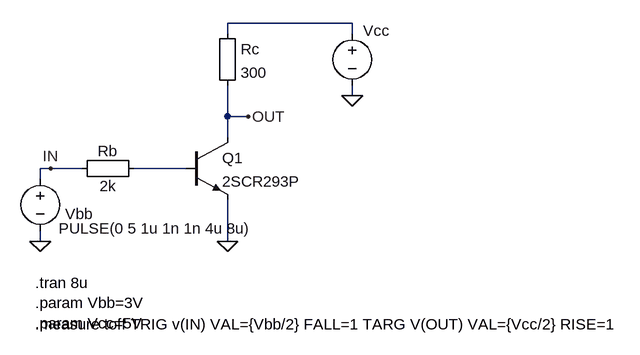
[diagram p0: schematic BT-CE-SWITCH-2.asc]
BT-CE-SWITCH-2.asc, the LTspice schematic file:
Version 4
SHEET 1 880 680
WIRE 400 -96 208 -96
WIRE 208 -80 208 -96
WIRE 400 -80 400 -96
WIRE 400 16 400 0
WIRE 208 48 208 0
WIRE 240 48 208 48
WIRE 208 80 208 48
WIRE -64 128 -80 128
WIRE -16 128 -64 128
WIRE 144 128 64 128
WIRE -80 144 -80 128
WIRE -80 240 -80 224
WIRE 208 240 208 176
FLAG 208 240 0
FLAG -80 240 0
FLAG 400 16 0
FLAG -64 128 IN
FLAG 240 48 OUT
SYMBOL Misc\\EuropeanResistor 192 -96 R0
SYMATTR InstName Rc
SYMATTR Value 300
SYMBOL Misc\\EuropeanResistor 80 112 R90
WINDOW 0 5 56 VBottom 2
WINDOW 3 27 56 VTop 2
SYMATTR InstName Rb
SYMATTR Value 2k
SYMBOL voltage -80 128 R0
WINDOW 3 28 92 Left 2
WINDOW 123 0 0 Left 2
WINDOW 39 38 88 Left 2
WINDOW 0 38 70 Left 2
SYMATTR Value PULSE(0 5 1u 1n 1n 4u 8u)
SYMATTR InstName Vbb
SYMBOL voltage 400 -96 R0
WINDOW 3 22 18 Invisible 2
WINDOW 123 0 0 Left 2
WINDOW 39 0 0 Left 2
WINDOW 0 17 12 Left 2
SYMATTR Value {Vcc}
SYMATTR InstName Vcc
SYMBOL npn 144 80 R0
SYMATTR InstName Q1
SYMATTR Value 2SCR293P
TEXT -88 304 Left 2 !.tran 8u\n.param Vbb=3V\n.param Vcc=5V
TEXT -88 368 Left 2 !.measure toff TRIG v(IN) VAL={Vbb/2} FALL=1 TARG V(OUT) VAL={Vcc/2} RISE=1

The netlist it stands for:
* BT-CE-SWITCH-2.asc
Rc N001 OUT 300
Rb N002 IN 2k
Vbb IN 0 PULSE(0 5 1u 1n 1n 4u 8u)
Vcc N001 0 {Vcc}
Q1 OUT N002 0 0 2SCR293P
.model NPN NPN
.model PNP PNP
.lib standard.bjt
.tran 8u
.param Vbb=3V
.param Vcc=5V
.measure toff TRIG v(IN) VAL={Vbb/2} FALL=1 TARG V(OUT) VAL={Vcc/2} RISE=1
.backanno
.end